# Altium schematic sheet backup.SchDoc
size A3
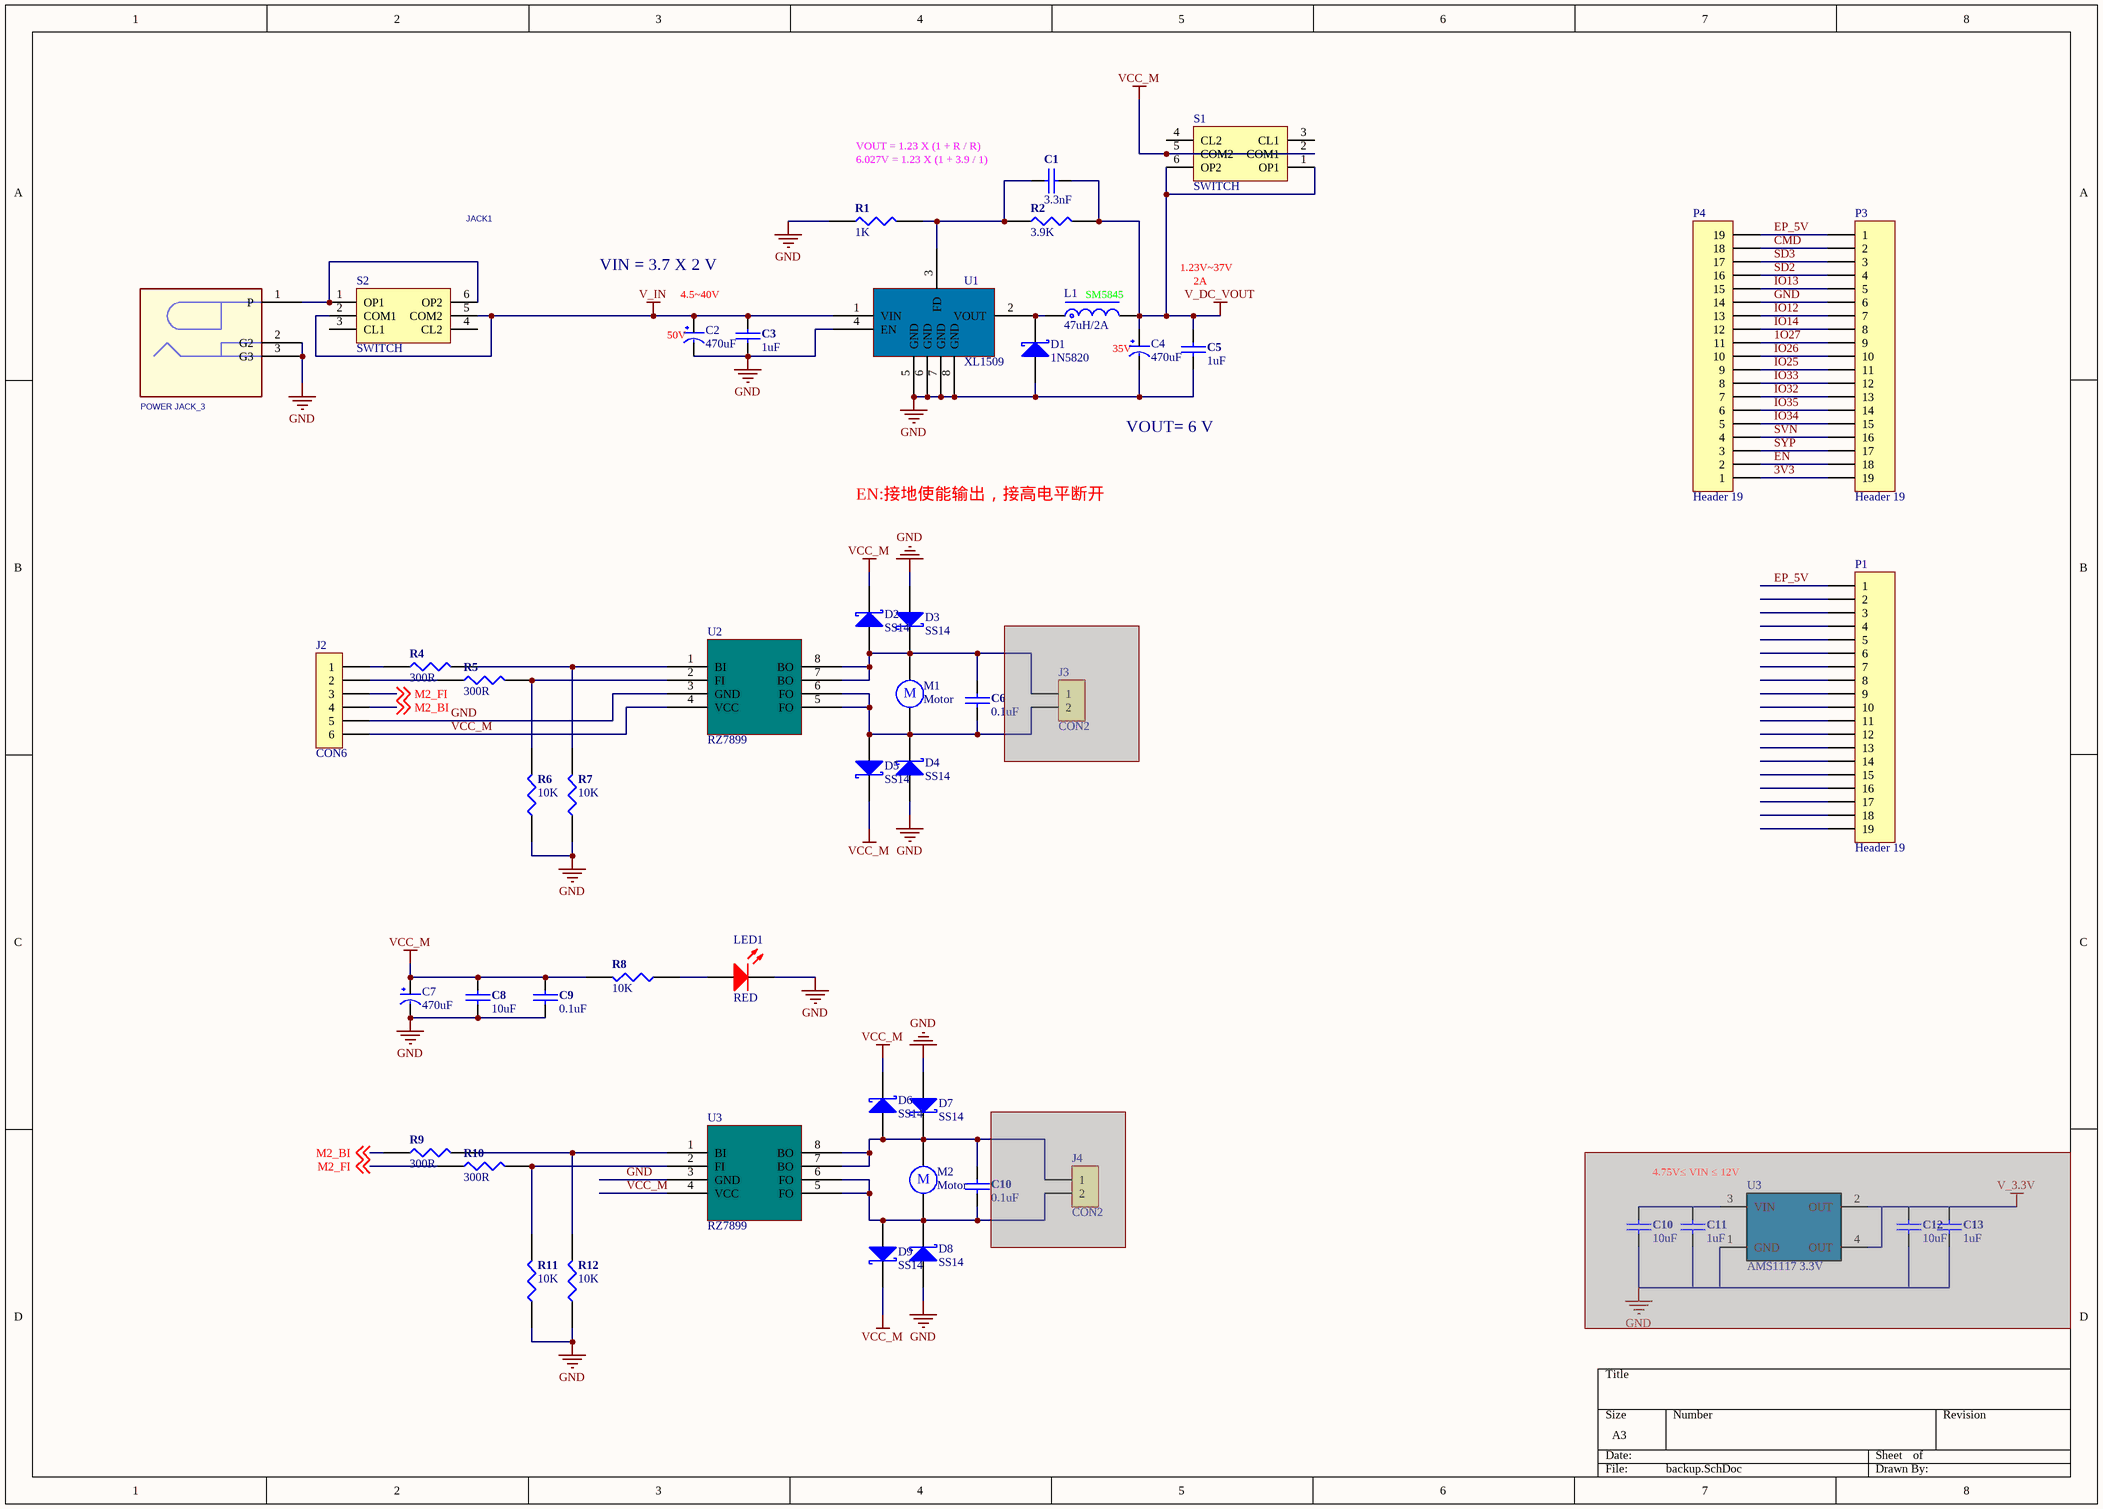
[diagram p0: backup.SchDoc]

## Parts
(Parts that share a designator on the sheet are numbered #1, #2 ... from top to bottom, then left to right.)
C1  3.3nF  [C0603]
C2  470uF  [CAP_UF_E12]
C3  1uF  [C0603]
C4  470uF  [CAP_UF_E12]
C5  1uF  [C0603]
C6  0.1uF  [C0603]
C7  470uF  [CAP_UF_E12]
C8  10uF  [C0603]
C9  0.1uF  [C0603]
C10#1  0.1uF  [C0603]
C10#2  10uF  [C0603]  (masked out: inside a compile mask, not in the netlist)
C11  1uF  [C0603]  (masked out: inside a compile mask, not in the netlist)
C12  10uF  [C0603]  (masked out: inside a compile mask, not in the netlist)
C13  1uF  [C0603]  (masked out: inside a compile mask, not in the netlist)
D1  1N5820  [SMA]
D2  SS14  [SMA]
D3  SS14  [SMA]
D4  SS14  [SMA]
D5  SS14  [SMA]
D6  SS14  [SMA]
D7  SS14  [SMA]
D8  SS14  [SMA]
D9  SS14  [SMA]
J2  CON6  [HDR1X6]
J3  CON2  [HDR1X2]  (masked out: inside a compile mask, not in the netlist)
J4  CON2  [HDR1X2]  (masked out: inside a compile mask, not in the netlist)
JACK1  POWER JACK_3  [jack-2_5mm_b]
L1  47uH/2A  [L_SM5845]
LED1  RED  [LED-0805-R]
M1  Motor  [PWR_2PIN]
M2  Motor  [PWR_2PIN]
P1  Header 19  [HDR1X19]
P3  Header 19  [HDR1X19]
P4  Header 19  [HDR1X19]
R1  1K  [R0603]
R2  3.9K  [R0603]
R4  300R  [R0603]
R5  300R  [R0603]
R6  10K  [R0603]
R7  10K  [R0603]
R8  10K  [R0603]
R9  300R  [R0603]
R10  300R  [R0603]
R11  10K  [R0603]
R12  10K  [R0603]
S1  SWITCH  [SWITCH_DDSZ]
S2  SWITCH  [SWITCH_DDSZ]
U1  XL1509  [SOP-8]
U2  RZ7899  [SOP-8]
U3#1  RZ7899  [SOP-8]
U3#2  AMS1117 3.3V  [AMS1117]  (masked out: inside a compile mask, not in the netlist)

## Nets
GND: C2.2(GND) C3.2 C4.2(GND) C5.2 C7.2(GND) C8.2 C9.2 D1.1(A) D3.1(A) D4.1(A) D7.1(A) D8.1(A) J2.5 JACK1.2(G2) JACK1.3(G3) LED1.2(K) P3.6 P4.14 R1.1 R6.1 R7.1 R11.1 R12.1 U1.4(EN) U1.5(GND) U1.6(GND) U1.7(GND) U1.8(GND) U2.3(GND) U3#1.3(GND)
V_DC_VOUT: C1.2 C4.1(VCC) C5.1 L1.2 R2.2 S1.1(OP1) S1.6(OP2)
V_IN: C2.1(VCC) C3.1 S2.2(COM1) S2.5(COM2) U1.1(VIN)
VCC_M: C7.1(VCC) C8.1 C9.1 D2.2(K) D5.2(K) D6.2(K) D9.2(K) J2.6 R8.2 S1.2(COM1) S1.5(COM2) U2.4(VCC) U3#1.4(VCC)
1O27: P3.9 P4.11
3V3: P3.19 P4.1
CMD: P3.2 P4.18
EN: P3.18 P4.2
EP_5V: P1.1 P3.1 P4.19
IO12: P3.7 P4.13
IO13: P3.5 P4.15
IO14: P3.8 P4.12
IO25: P3.11 P4.9
IO26: P3.10 P4.10
IO32: P3.13 P4.7
IO33: P3.12 P4.8
IO34: P3.15 P4.5
IO35: P3.14 P4.6
M2_BI: J2.4 R9.1 ; off-sheet M2_BI
M2_FI: J2.3 R10.1 ; off-sheet M2_FI
SD2: P3.4 P4.16
SD3: P3.3 P4.17
SVN: P3.16 P4.4
SYP: P3.17 P4.3
NetC1_1: C1.1 R1.2 R2.1 U1.3(FD)
NetC6_1: C6.1 D2.1(A) D3.2(K) M1.1 U2.7(BO) U2.8(BO)
NetC6_2: C6.2 D4.2(K) D5.1(A) M1.2 U2.5(FO) U2.6(FO)
NetC10#1_1: C10#1.1 D6.1(A) D7.2(K) M2.1 U3#1.7(BO) U3#1.8(BO)
NetC10#1_2: C10#1.2 D8.2(K) D9.1(A) M2.2 U3#1.5(FO) U3#1.6(FO)
NetD1_2: D1.2(K) L1.1 U1.2(VOUT)
NetJ2_1: J2.1 R4.1
NetJ2_2: J2.2 R5.1
NetJACK1_1: JACK1.1(P) S2.1(OP1) S2.6(OP2)
NetLED1_1: LED1.1(A) R8.1
NetR4_2: R4.2 R7.2 U2.1(BI)
NetR5_2: R5.2 R6.2 U2.2(FI)
NetR9_2: R9.2 R12.2 U3#1.1(BI)
NetR10_2: R10.2 R11.2 U3#1.2(FI)

Not connected (* = marked no-connect by the designer): P1 2 3 4 5 6 7 8 9 10 11 12 13 14 15 16 17 18 19; S1 3(CL1) 4(CL2); S2 3(CL1) 4(CL2)

## Notes on the sheet
- VOUT = 1.23 X (1 + R / R)
- 6.027V = 1.23 X (1 + 3.9 / 1)
- VIN = 3.7 X 2 V
- 4.5~40V
- (near L1) SM5845
- 1.23V~37V
- 2A
- (near C2) 50V
- (near C4) 35V
- VOUT= 6 V
- EN:接地使能输出，接高电平断开
- 4.75V≤ VIN ≤ 12V
- (in symbol Motor_720) M

## Library data of the parts
C1 C3 C5 C6 C8 C9 C10#1 C10#2 C11-C13 = CAP: SMT电容; Precision: 6.3V耐压
C2 C4 C7 = CAP_1
D1-D9 = Diode BAT17: Silicon RF Schottky Diode for Mixer Applications in the VHF/UHF Range; Note: Pin 2 is not connected and not drawn.; Published: 21-Mar-2003; DatasheetDocument: Oct-1999; PackageDocument: Sep-2001; PackageReference: SOT-23; Publisher: Altium Limited; ComponentLink1Description: Manufacturer Link; ComponentLink1URL: http://www.infineon.com/; ComponentLink2Description: Datasheet; ComponentLink2URL: http://www.infineon.com/upload/Document/cmc_upload/documents/009/363/bat17series.pdf
J2 = CON6: Connector
J3 J4 = CON2: Connector
L1 = L-CD: 贴片功率电感; BOM名称: 功率电感; 版权归属: 源创客; 学习资源: www.ooocke.com
LED1 = LED1
M1 M2 = Motor_720: Motor, General Kind; Published: 8-August-2017; PackageReference: RB5-10.5; Publisher: mazhongwei
P1 P3 P4 = Header 19: Header, 19-Pin; LatestRevisionDate: 17-Jul-2002; LatestRevisionNote: Re-released for DXP Platform.; Publisher: Altium Limited
R1 R2 R4-R12 = RES1: SMT电阻; Precision: 5% 精度; LIB: SMT 电阻
U3#2 = AMS1117